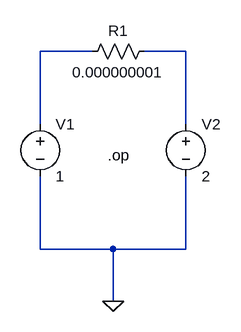
[diagram p0: schematic Q1b.asc]
Q1b.asc, the LTspice schematic file:
Version 4
SHEET 1 880 680
WIRE 240 160 160 160
WIRE 384 160 320 160
WIRE 160 272 160 160
WIRE 384 272 384 160
WIRE 160 464 160 352
WIRE 272 464 160 464
WIRE 384 464 384 352
WIRE 384 464 272 464
WIRE 272 544 272 464
FLAG 272 544 0
SYMBOL voltage 160 256 R0
SYMATTR InstName V1
SYMATTR Value 1
SYMBOL voltage 384 256 R0
SYMATTR InstName V2
SYMATTR Value 2
SYMBOL res 224 176 R270
WINDOW 0 32 56 VTop 2
WINDOW 3 0 56 VBottom 2
SYMATTR InstName R1
SYMATTR Value 0.000000001
TEXT 264 320 Left 2 !.op

The netlist it stands for:
* Q1b.asc
V1 N001 0 1
V2 N002 0 2
R1 N001 N002 0.000000001
.op
.backanno
.end